# Altium schematic sheet 7_peripherals.SchDoc
size A4; SheetNumber: 7; SheetTotal: 7
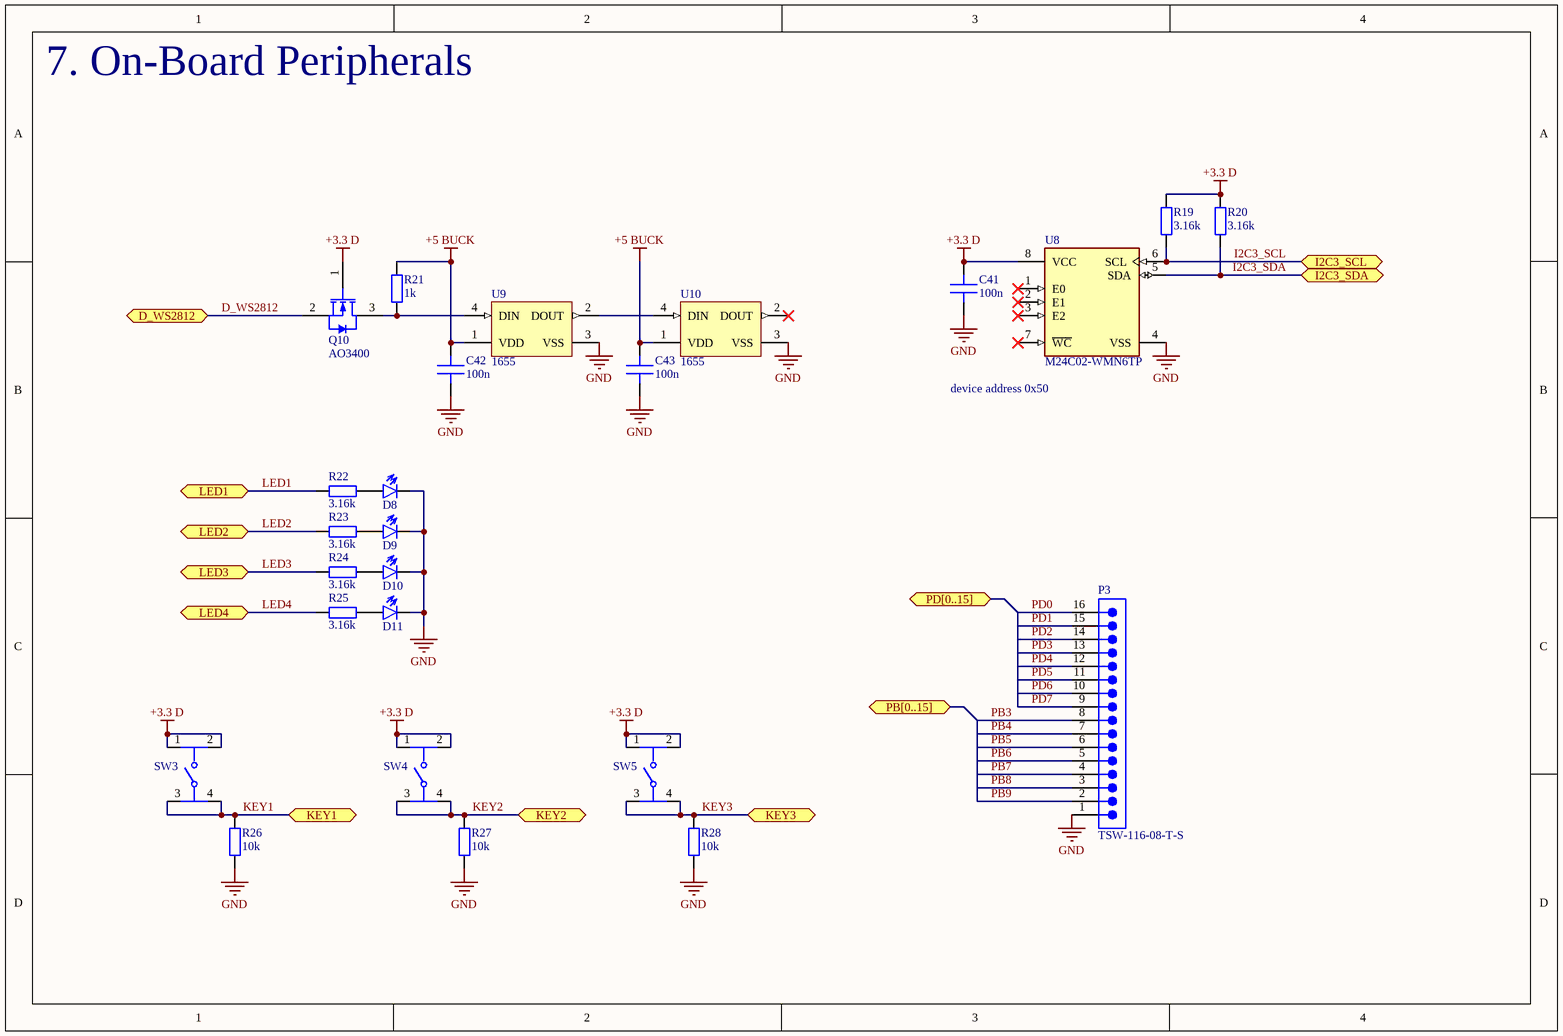
[diagram p0: 7_peripherals.SchDoc]

## Parts
C41  100n  [IPC C C0402 NO SILK]
C42  100n  [IPC C C0402 NO SILK]
C43  100n  [IPC C C0402 NO SILK]
D8  Yellow LED 0603  [IPC C D0603]  (value not drawn)
D9  Yellow LED 0603  [IPC C D0603]  (value not drawn)
D10  Yellow LED 0603  [IPC C D0603]  (value not drawn)
D11  Yellow LED 0603  [IPC C D0603]  (value not drawn)
P3  TSW-116-08-T-S  [SMTC-TSW-116-08-X-S]
Q10  AO3400  [AO-SOT23-3_V]
R19  3.16k  [IPC C R0402 NO SILK]
R20  3.16k  [IPC C R0402 NO SILK]
R21  1k  [IPC C R0402 NO SILK]
R22  3.16k  [IPC C R0402 NO SILK]
R23  3.16k  [IPC C R0402 NO SILK]
R24  3.16k  [IPC C R0402 NO SILK]
R25  3.16k  [IPC C R0402 NO SILK]
R26  10k  [IPC C R0402 NO SILK]
R27  10k  [IPC C R0402 NO SILK]
R28  10k  [IPC C R0402 NO SILK]
SW3  PTS810SJM250SMTRLFS  [FP-PTS810SJM250SMTRLFS-MFG]  (value not drawn)
SW4  PTS810SJM250SMTRLFS  [FP-PTS810SJM250SMTRLFS-MFG]  (value not drawn)
SW5  PTS810SJM250SMTRLFS  [FP-PTS810SJM250SMTRLFS-MFG]  (value not drawn)
U8  M24C02-WMN6TP  [FP-SO8N-SO-A-MFG]
U9  1655  [ADA-RGB-1655_V]
U10  1655  [ADA-RGB-1655_V]

## Ports
D_WS2812 (bidir, see 2_mcu[1D]), I2C3_SCL (bidir, see 2_mcu[3C]), I2C3_SDA (bidir, see 2_mcu[3D]), KEY1 (bidir, see 2_mcu[2C]), KEY2 (bidir, see 2_mcu[2C]), KEY3 (bidir, see 2_mcu[2D]), LED1 (bidir, see 2_mcu[3D]), LED2 (bidir, see 2_mcu[3D]), LED3 (bidir, see 2_mcu[3D]), LED4 (bidir, see 2_mcu[3C]), PB[0..15] (bidir, see 2_mcu[4B]), PD[0..15] (bidir, see 2_mcu[1C])

## Nets
+3.3 D: C41.2 Q10.1(G) R19.2 R20.2 SW3.1 SW3.2 SW4.1 SW4.2 SW5.1 SW5.2 U8.8(VCC)
+5 BUCK: C42.2 C43.2 R21.2 U9.1(VDD) U10.1(VDD)
GND: C41.1 C42.1 C43.1 D8.2(C) D9.2(C) D10.2(C) D11.2(C) P3.1 R26.2 R27.2 R28.2 U8.4(VSS) U9.3(VSS) U10.3(VSS)
D_WS2812: Q10.2(S) ; port D_WS2812
I2C3_SCL: R19.1 U8.6(SCL) ; port I2C3_SCL
I2C3_SDA: R20.1 U8.5(SDA) ; port I2C3_SDA
KEY1: R26.1 SW3.3 SW3.4 ; port KEY1
KEY2: R27.1 SW4.3 SW4.4 ; port KEY2
KEY3: R28.1 SW5.3 SW5.4 ; port KEY3
LED1: R22.2 ; port LED1
LED2: R23.2 ; port LED2
LED3: R24.2 ; port LED3
LED4: R25.2 ; port LED4
PB3: P3.8
PB4: P3.7
PB5: P3.6
PB6: P3.5
PB7: P3.4
PB8: P3.3
PB9: P3.2
PD0: P3.16
PD1: P3.15
PD2: P3.14
PD3: P3.13
PD4: P3.12
PD5: P3.11
PD6: P3.10
PD7: P3.9
NetD8_1: D8.1(A) R22.1
NetD9_1: D9.1(A) R23.1
NetD10_1: D10.1(A) R24.1
NetD11_1: D11.1(A) R25.1
NetQ10_3: Q10.3(D) R21.1 U9.4(DIN)
NetU9_2: U9.2(DOUT) U10.4(DIN)

Not connected (* = marked no-connect by the designer): U8 1(E0)* 2(E1)* 3(E2)* 7(~{WC})*; U10 2(DOUT)*

## Notes on the sheet
- 7. On-Board Peripherals
- (near U8) device address 0x50

## Library data of the parts
C41-C43 = Generic CAP 0402: Value: 100n
D8-D11 = Generic LED 0603
P3 = CMP-1024-00438-1: 0.025" SQ Post Header, Through-hole, Vertical, -55 to 105 degC, 2.54 mm Pitch, 16-Pin, Male, RoHS; Manufacturer: Samtec; Pitch: 2.54 mm; PackageDescription: .025[0.64] SQ. Post Terminal Strip Assembly; Orientation: Vertical; DatasheetVersion: F-214; ComponentLink2URL: http://www.samtec.com/documents/webfiles/pdf/TSW_TH.PDF; ComponentLink3URL: http://www.samtec.com/documents/webfiles/cpdf/TSW-XXX-XX-XXX-X-XX-XXX-MKT.pdf; ComponentLink1URL: http://www.samtec.com; PackageReference: TSW-116-08-X-S; ComponentLink2Description: Datasheet; ComponentLink1Description: Manufacturer URL; ComponentLink3Description: Package Specification; Temperature Range: -55 to 105 degC; Mounting Technology: Through-hole; PartNumber: TSW-116-08-T-S; PackageVersion: DM, 8/1988; RoHS: True
Q10 = CMP-0278-00001-1: N-channel Enhancement Mode Field-Effect Transistor; 5.8A/30V; Manufacturer: Alpha and Omega; Channel Type: N; Drain-Source Voltage Limit: 30 V; Junction Temperature: -55 to 150 degC; Gate-Source Voltage Limit: +/-12 V; PackageDescription: 3-Pin SOT23, 3.016 x 2.8 mm Body, 0.95 mm Pitch; ComponentLink2Description: Datasheet; DatasheetVersion: Rev.8, 12/2011; ComponentLink3URL: http://www.aosmd.com/res/packaging_information/SOT-23.pdf; Storage Temperature: -55 to 150 degC; ComponentLink3Description: Package Specification; PackageReference: SOT23; ComponentLink1Description: Manufacturer URL; Mounting Technology: Surface Mount; ComponentLink1URL: http://www.aosmd.com/; PartNumber: AO3400; ComponentLink2URL: http://www.aosmd.com/res/data_sheets/AO3400.pdf
R19-R28 = Generic RES 0402
  R19 R20 R22-R25: Value: 3.16k
  R21: Value: 1k
  R26-R28: Value: 10k
SW3-SW5 = CMP-10040-000001-2: SWITCH TACTILE SPST-NO 0.05A 16V; Throw Configuration: SPST; Operating Force: 160gf; Actuator Type: Standard; Switch Travel: 0.15mm; Switch Function: Off-Mom; Max Current Rating: 50mA; Mechanical Life: 150000Cycles; Illumination Type: Non-Illuminated; Package Quantity: 2900; Depth: 4.6mm; Mount: Surface Mount; Packaging: Tape and Reel; Length: 3.2mm; RoHS Compliant: Yes; Case/Package: SMD/SMT; Voltage Rating (DC): 16V; Min Operating Temperature: -40°C; Termination: J-Bend; Lead Free: Lead Free; Contact Plating: Silver; Orientation: Straight; Max Operating Temperature: 85°C; Current Rating: 50mA; Color: Black
U8 = CMP-2000-05370-2: IC EEPROM 2K I2C 400KHZ 8SO; Manufacturer: STMicroelectronics; Min Supply Voltage: 2.5V; Standoff Height: 0.1mm; Nominal Supply Current: 0.5-1mA; Access Time: 900ns; Memory Size: 2Kbits; Max Supply Voltage: 5.5V; Digikey Description: IC EEPROM 2K I2C 400KHZ 8SO; Memory Type: EEPROM; ComponentLink2URL: https://www.st.com/resource/en/datasheet/m24c02-w.pdf; Device Class L3: EEPROM; Interface: I2C; Temperature Range High: +85°C; Mouser Description: M24C02 Series 2 Kb (256 x 8) 2.5 V SMT Serial I²C Bus EEPROM - SOIC-8; RoHS: TRUE; Lead Free: Yes; Ambient Temperature Range Low: -40°C; Temperature: -40°C to +85°C; Device Class L1: Integrated Circuits (ICs); Temperature Range Low: -40°C; Frequency: 400kHz; Category: IC; Manufacturer Part Number: M24C02-WMN6TP; Height: 1.75mm; Octopart: https://octopart.com/m24c02-wmn6tp-stmicroelectronics-55404516; Automotive: No; Ambient Temperature Range High: +85°C; ComponentLink2Description: Datasheet; Package: SO8N-SO-A; Device Class L2: Memory
U9 U10 = CMP-2000-05026-1: Intelligent Control LED Integrated Light Source, 3.5 to 5.3 V, -25 to 80 degC, 4-Pin SMD, RoHS, Tape and Reel; Manufacturer: Adafruit-Industries-LLC; Number of LEDs: 10; Configuration: Discrete; Utilized LED: WS2812(5050); Datasheet URL: http://datasheet.octopart.com/ADA1655-Adafruit-Industries-datasheet-32028139.pdf; Series: Neopixel; Interface: -; Package Description: 4-Pin Surface Mount Device, Body 5 x 5 mm; Color: Red,Green,Blue(RGB); Category: Optoelectronics; Controller Type: -; Package Reference: 1655; Manufacturer URL: https://www.adafruit.com/; Mounting Type: SurfaceMount; Datasheet Version: May-13; Size / Dimension: 5.00mmLx5.00mmW; Family: Addressable,Specialty